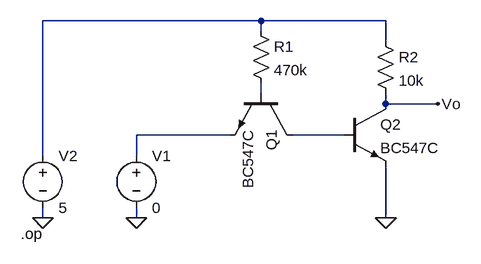
[diagram p0: schematic ttl.asc]
ttl.asc, the LTspice schematic file:
Version 4
SHEET 1 880 680
WIRE 160 16 -176 16
WIRE 352 16 160 16
WIRE 160 32 160 16
WIRE 352 48 352 16
WIRE 160 128 160 112
WIRE 352 144 352 128
WIRE 432 144 352 144
WIRE 112 192 -32 192
WIRE 288 192 208 192
WIRE -176 224 -176 16
WIRE -32 224 -32 192
WIRE -176 320 -176 304
WIRE -32 320 -32 304
WIRE 352 320 352 240
FLAG -32 320 0
FLAG -176 320 0
FLAG 352 320 0
FLAG 432 144 Vo
SYMBOL npn 208 128 R90
SYMATTR InstName Q1
SYMATTR Value BC547C
SYMBOL npn 288 144 R0
SYMATTR InstName Q2
SYMATTR Value BC547C
SYMBOL res 144 16 R0
SYMATTR InstName R1
SYMATTR Value 470k
SYMBOL res 336 32 R0
SYMATTR InstName R2
SYMATTR Value 10k
SYMBOL voltage -32 208 R0
WINDOW 123 0 0 Left 0
WINDOW 39 0 0 Left 0
SYMATTR InstName V1
SYMATTR Value 0
SYMBOL voltage -176 208 R0
WINDOW 123 0 0 Left 0
WINDOW 39 0 0 Left 0
SYMATTR InstName V2
SYMATTR Value 5
TEXT -210 344 Left 2 !.op

The netlist it stands for:
* ttl.asc
Q1 N004 N002 N003 0 BC547C
Q2 Vo N004 0 0 BC547C
R1 N001 N002 470k
R2 N001 Vo 10k
V1 N003 0 0
V2 N001 0 5
.model NPN NPN
.model PNP PNP
.lib standard.bjt
.op
.backanno
.end